# EAGLE design untitled (EAGLE 7.5.0)
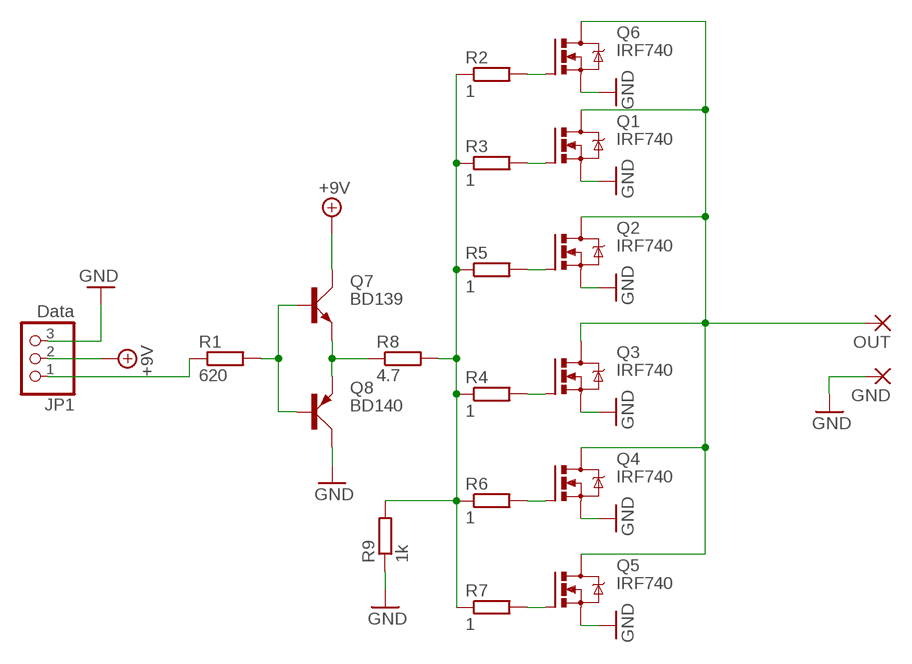
[diagram p0: schematic, sheet 1]

## Parts
GND  WIREPADSMD5-2,5  [5-2,5]
JP1  Data  PINHD-1X3  [1X03]
OUT  WIREPADSMD5-2,5  [5-2,5]
Q1  IRF740  [TO220BV]
Q2  IRF740  [TO220BV]
Q3  IRF740  [TO220BV]
Q4  IRF740  [TO220BV]
Q5  IRF740  [TO220BV]
Q6  IRF740  [TO220BV]
Q7  BD139  [TO126AV]
Q8  BD140  [TO126AV]
R1  620  R-EU_R0805  [R0805]
R2  1  R-EU_R0805  [R0805]
R3  1  R-EU_R0805  [R0805]
R4  1  R-EU_R0805  [R0805]
R5  1  R-EU_R0805  [R0805]
R6  1  R-EU_R0805  [R0805]
R7  1  R-EU_R0805  [R0805]
R8  4.7  R-EU_R0805  [R0805]
R9  1k  R-EU_R0805  [R0805]

## Nets
+9V: JP1.2 Q7.C
GND: GND.1(P) JP1.3 Q1.S Q2.S Q3.S Q4.S Q5.S Q6.S Q8.C R9.1
N$2: Q7.B Q8.B R1.2
N$3: OUT.1(P) Q1.D Q2.D Q3.D Q4.D Q5.D Q6.D
N$4: Q7.E Q8.E R8.1
N$5: R2.1 R3.1 R4.1 R5.1 R6.1 R7.1 R8.2 R9.2
N$6: Q6.G R2.2
N$7: Q1.G R3.2
N$8: Q2.G R5.2
N$9: Q3.G R4.2
N$10: Q4.G R6.2
N$11: Q5.G R7.2
N$12: JP1.1 R1.1

## Library data of the parts
GND OUT = wirepad:WIREPAD: Wire PAD connect wire on PCB
JP1 = pinhead:PINHD-1X3: PIN HEADER
Q1-Q6 = transistor-power:IRF740: N-CHANNEL MOS FET
Q7 = transistor-power:BD139: NPN TRANSISTOR
Q8 = transistor-power:BD140: PNP TRANSISTOR
R1 R9 = resistor:R-EU_: RESISTOR, European symbol
R2-R8 = rcl:R-EU_: RESISTOR, European symbol

## Board
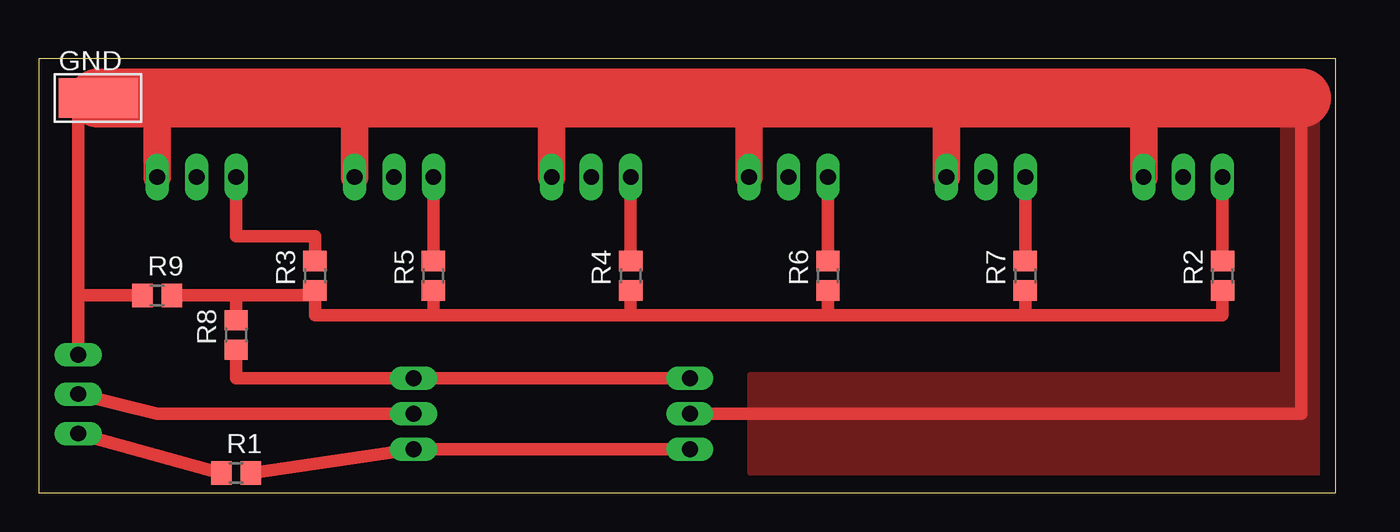
[diagram p1: board, top side]
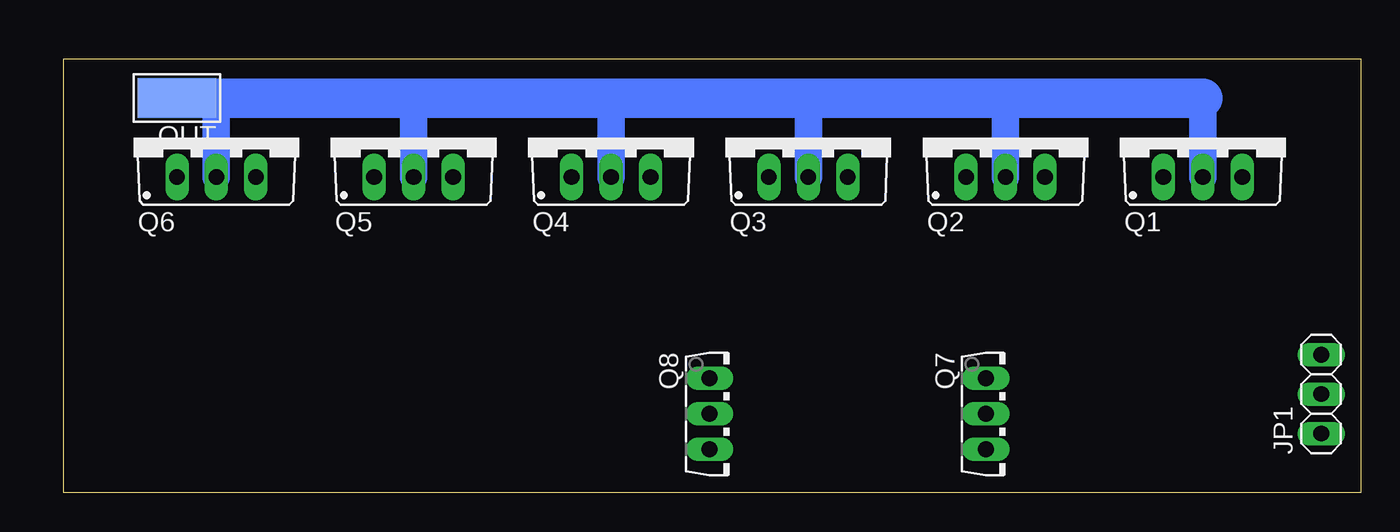
[diagram p2: board, bottom side, seen from below]

Size 83.49 x 27.93 mm. Coordinates in mm from the lower left corner, seen from the top.
Outline: 0,0 83.49,0 83.49,27.93 0,27.93 0,0
Copper layers (1*16): Top 0.035mm / dielectric 1.5mm / Bottom 0.035mm
Design rules "default": minimum track width 10mil, minimum drill 24mil, track to track 8mil, track to pad 8mil, pad to pad 8mil, via to via 8mil, smd to smd 8mil, copper to edge 40mil, drill to drill 8mil, minimum pad ring 10mil, minimum via ring 8mil, stop-mask expansion 4mil, vias tented up to drill 0mil, thermal gap 10mil

### Footprints (pad centres in the part's own frame; a part is rotated, then mirrored left to right if it is on the bottom)
5-2,5 = smd 2.54 x 5.08: 1 0,0
1X03 = drill 1.016 long: 1 -2.54,0; 2 0,0; 3 2.54,0
TO220BV = drill 1.016 long: D 0,-2.54; G -2.54,-2.54; S 2.54,-2.54
TO126AV = drill 1.016 long: B 2.286,-1.27; C 0,-1.27; E -2.286,-1.27
R0805 = smd 1.3 x 1.5: 1 -0.95,0; 2 0.95,0

### Placement (x,y rotation side)
GND  3.81,25.4 270 top
JP1  2.54,6.35 90 bottom
OUT  76.2,25.4 90 bottom
Q1  10.16,22.86 0 bottom
Q2  22.86,22.86 0 bottom
Q3  35.56,22.86 0 bottom
Q4  48.26,22.86 0 bottom
Q5  60.96,22.86 0 bottom
Q6  73.66,22.86 0 bottom
Q7  22.86,5.08 270 bottom
Q8  40.64,5.08 270 bottom
R1  12.7,1.27 0 top
R2  76.2,13.97 90 top
R3  17.78,13.97 90 top
R4  38.1,13.97 90 top
R5  25.4,13.97 90 top
R6  50.8,13.97 90 top
R7  63.5,13.97 90 top
R8  12.7,10.16 90 top
R9  7.62,12.7 0 top

### Tracks (layer width: path | path; a pad name or v marks a point on that pad's centre or on a via)
+9V
  Top 0.813: JP1.2 7.62,5.08 Q7.C
GND
  Top 0.813: GND.1 2.54,24.13 2.54,12.7 | 2.54,12.7 JP1.3 arc-90 2.86,9.21 | Q8.C 81.28,5.08 81.28,25.4 | R9.1 2.54,12.7
  Top 1.778: Q1.S 7.62,25.4 | Q6.S 71.12,25.4 | Q2.S 20.32,25.4 | Q3.S 33.02,25.4 | Q4.S 45.72,25.4 | Q5.S 58.42,25.4
  Top 3.81: 81.28,25.4 71.12,25.4 58.42,25.4 45.72,25.4 33.02,25.4 20.32,25.4 7.62,25.4 GND.1
  pour Top: 45.72,7.62 45.72,1.27 82.55,1.27 82.55,26.67 80.01,26.67 80.01,7.62
N$2
  Top 0.813: Q8.B Q7.B R1.2
N$3
  Bottom 1.778: OUT.1 73.66,25.4 Q6.D | Q1.D 10.16,25.4 | 22.86,25.4 Q2.D | Q3.D 35.56,25.4 | Q5.D 60.96,25.4 | Q4.D 48.26,25.4
  Bottom 2.54: 73.66,25.4 60.96,25.4 48.26,25.4 35.56,25.4 22.86,25.4 10.16,25.4
N$4
  Top 0.813: Q8.E Q7.E 12.7,7.37 R8.1
N$5
  Top 0.813: R2.1 76.2,11.43 63.5,11.43 | R7.1 63.5,11.43 | 63.5,11.43 50.8,11.43 | R6.1 50.8,11.43 | 50.8,11.43 38.1,11.43 | R4.1 38.1,11.43 | 38.1,11.43 25.4,11.43 | R5.1 25.4,11.43 | 25.4,11.43 17.78,11.43 R3.1 17.78,12.7 12.7,12.7 | R9.2 12.7,12.7 | R8.2 12.7,12.7
N$6
  Top 0.813: R2.2 Q6.G
N$7
  Top 0.813: R3.2 17.78,16.51 12.7,16.51 Q1.G
N$8
  Top 0.813: R5.2 Q2.G
N$9
  Top 0.813: R4.2 Q3.G
N$10
  Top 0.813: R6.2 Q4.G
N$11
  Top 0.813: R7.2 Q5.G
N$12
  Top 0.813: JP1.1 R1.1